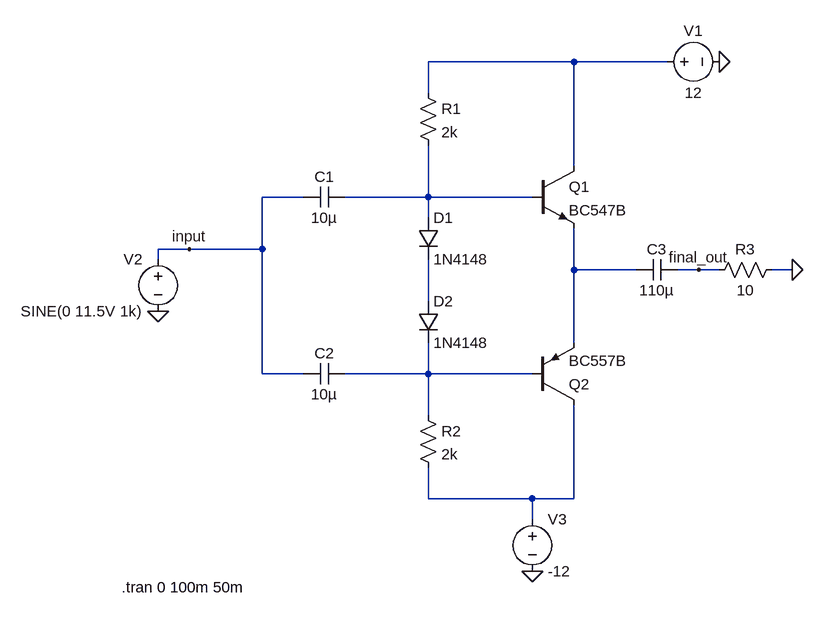
[diagram p0: schematic 4th_stage_power_amplifier.asc]
4th_stage_power_amplifier.asc, the LTspice schematic file:
Version 4
SHEET 1 880 728
WIRE 496 -96 272 -96
WIRE 640 -96 496 -96
WIRE 272 -48 272 -96
WIRE 496 64 496 -96
WIRE 80 112 16 112
WIRE 272 112 272 32
WIRE 272 112 144 112
WIRE 432 112 272 112
WIRE 272 144 272 112
WIRE -96 192 -144 192
WIRE 16 192 16 112
WIRE 16 192 -96 192
WIRE -144 208 -144 192
WIRE 496 224 496 160
WIRE 592 224 496 224
WIRE 688 224 656 224
WIRE 720 224 688 224
WIRE 832 224 800 224
WIRE 272 272 272 208
WIRE 496 336 496 224
WIRE 16 384 16 192
WIRE 80 384 16 384
WIRE 272 384 272 336
WIRE 272 384 144 384
WIRE 432 384 272 384
WIRE 272 448 272 384
WIRE 272 576 272 528
WIRE 432 576 272 576
WIRE 496 576 496 432
WIRE 496 576 432 576
WIRE 432 608 432 576
FLAG 832 224 0
FLAG -144 288 0
FLAG 720 -96 0
FLAG 432 688 0
FLAG 688 224 final_out
FLAG -96 192 input
SYMBOL cap 144 96 R90
WINDOW 0 0 32 VBottom 2
WINDOW 3 32 32 VTop 2
SYMATTR InstName C1
SYMATTR Value 10µ
SYMBOL cap 144 368 R90
WINDOW 0 0 32 VBottom 2
WINDOW 3 32 32 VTop 2
SYMATTR InstName C2
SYMATTR Value 10µ
SYMBOL res 256 -64 R0
SYMATTR InstName R1
SYMATTR Value 2k
SYMBOL res 256 432 R0
SYMATTR InstName R2
SYMATTR Value 2k
SYMBOL npn 432 64 R0
SYMATTR InstName Q1
SYMATTR Value BC547B
SYMBOL pnp 432 432 M180
SYMATTR InstName Q2
SYMATTR Value BC557B
SYMBOL diode 256 144 R0
SYMATTR InstName D1
SYMATTR Value 1N4148
SYMBOL diode 256 272 R0
SYMATTR InstName D2
SYMATTR Value 1N4148
SYMBOL voltage 624 -96 R270
WINDOW 0 32 56 VTop 2
WINDOW 3 -32 56 VBottom 2
WINDOW 123 0 0 Left 0
WINDOW 39 0 0 Left 0
SYMATTR InstName V1
SYMATTR Value 12
SYMBOL res 816 208 R90
WINDOW 0 0 56 VBottom 2
WINDOW 3 32 56 VTop 2
SYMATTR InstName R3
SYMATTR Value 10
SYMBOL voltage -144 192 M0
WINDOW 123 0 0 Left 0
WINDOW 39 0 0 Left 0
SYMATTR InstName V2
SYMATTR Value SINE(0 11.5V 1k)
SYMBOL voltage 432 592 R0
WINDOW 123 0 0 Left 0
WINDOW 39 0 0 Left 0
SYMATTR InstName V3
SYMATTR Value -12
SYMBOL cap 656 208 R90
WINDOW 0 0 32 VBottom 2
WINDOW 3 32 32 VTop 2
SYMATTR InstName C3
SYMATTR Value 110µ
TEXT -200 712 Left 2 !.tran 0 100m 50m

The netlist it stands for:
* 4th_stage_power_amplifier.asc
C1 N002 input 10µ
C2 N005 input 10µ
R1 N001 N002 2k
R2 N005 N006 2k
Q1 N001 N002 N003 0 BC547B
Q2 N006 N005 N003 0 BC557B
D1 N002 N004 1N4148
D2 N004 N005 1N4148
V1 N001 0 12
R3 0 final_out 10
V2 input 0 SINE(0 11.5V 1k)
V3 N006 0 -12
C3 final_out N003 110µ
.model D D
.lib standard.dio
.model NPN NPN
.model PNP PNP
.lib standard.bjt
.tran 0 100m 50m
.backanno
.end